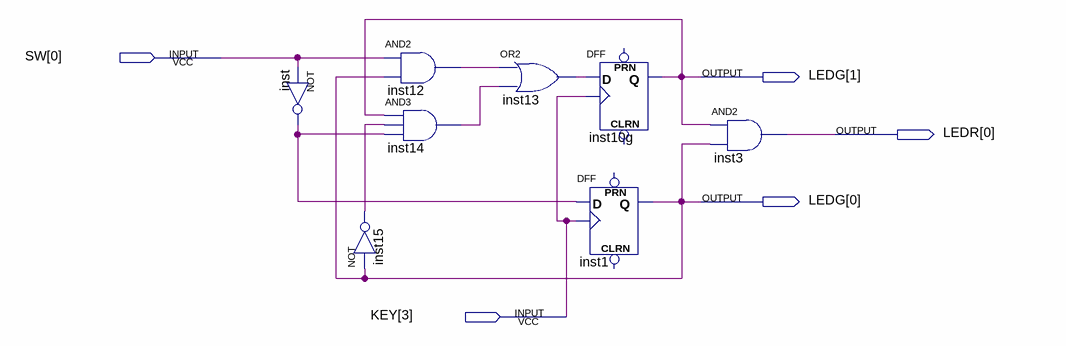
[diagram p0: schematic sheet]
// Quartus schematic LAB2_Moore.bdf as structural Verilog: 8 symbols, 5 pins
module LAB2_Moore (
  input  [0:0] SW,
  input  [3:3] KEY,
  output [1:0] LEDG,
  output [0:0] LEDR
);

  wire inst12_out, inst13_out, inst14_out, inst15_out, inst_out;

  not inst (inst_out, SW[0]);
  and inst12 (inst12_out, SW[0], LEDG[0]);
  and inst14 (inst14_out, LEDG[1], inst15_out, inst_out);
  not inst15 (inst15_out, LEDG[0]);
  or inst13 (inst13_out, inst12_out, inst14_out);
  DFF inst10g (.CLK(KEY[3]), .D(inst13_out), .Q(LEDG[1]));  // open: CLRN, PRN
  DFF inst1 (.CLK(KEY[3]), .D(inst_out), .Q(LEDG[0]));  // open: CLRN, PRN
  and inst3 (LEDR[0], LEDG[1], LEDG[0]);
endmodule
